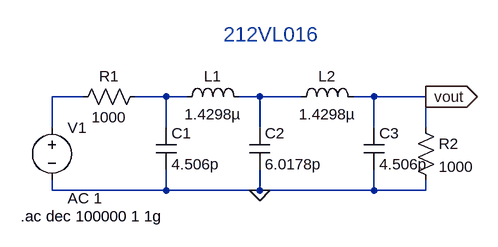
[diagram p0: schematic q1.asc]
q1.asc, the LTspice schematic file:
Version 4
SHEET 1 880 680
WIRE 48 96 0 96
WIRE 176 96 128 96
WIRE 208 96 176 96
WIRE 320 96 288 96
WIRE 384 96 320 96
WIRE 496 96 464 96
WIRE 576 96 496 96
WIRE 0 144 0 96
WIRE 176 144 176 96
WIRE 320 144 320 96
WIRE 496 144 496 96
WIRE 576 144 576 96
WIRE 0 240 0 224
WIRE 176 240 176 208
WIRE 176 240 0 240
WIRE 320 240 320 208
WIRE 320 240 176 240
WIRE 496 240 496 208
WIRE 496 240 320 240
WIRE 576 240 576 224
WIRE 576 240 496 240
FLAG 320 240 0
FLAG 576 96 vout
IOPIN 576 96 Out
SYMBOL res 144 80 R90
WINDOW 0 0 56 VBottom 2
WINDOW 3 32 56 VTop 2
SYMATTR InstName R1
SYMATTR Value 1000
SYMBOL ind 192 112 R270
WINDOW 0 32 56 VTop 2
WINDOW 3 5 56 VBottom 2
SYMATTR InstName L1
SYMATTR Value 1.4298µ
SYMBOL ind 368 112 R270
WINDOW 0 32 56 VTop 2
WINDOW 3 5 56 VBottom 2
SYMATTR InstName L2
SYMATTR Value 1.4298µ
SYMBOL cap 160 144 R0
SYMATTR InstName C1
SYMATTR Value 4.506p
SYMBOL cap 304 144 R0
SYMATTR InstName C2
SYMATTR Value 6.0178p
SYMBOL cap 480 144 R0
SYMATTR InstName C3
SYMATTR Value 4.506p
SYMBOL res 560 128 R0
SYMATTR InstName R2
SYMATTR Value 1000
SYMBOL voltage 0 128 R0
WINDOW 123 24 124 Left 2
WINDOW 39 0 0 Left 0
SYMATTR Value2 AC 1
SYMATTR InstName V1
SYMATTR Value ""
TEXT -48 280 Left 2 !.ac dec 100000 1 1g
TEXT 264 0 Left 3 ;212VL016

The netlist it stands for:
* q1.asc
R1 N002 N001 1000
L1 N002 N003 1.4298µ
L2 N003 vout 1.4298µ
C1 N002 0 4.506p
C2 N003 0 6.0178p
C3 vout 0 4.506p
R2 vout 0 1000
V1 N001 0 AC 1
.ac dec 100000 1 1g
* 212VL016
.backanno
.end